# EAGLE design gearnode (EAGLE 5.07)
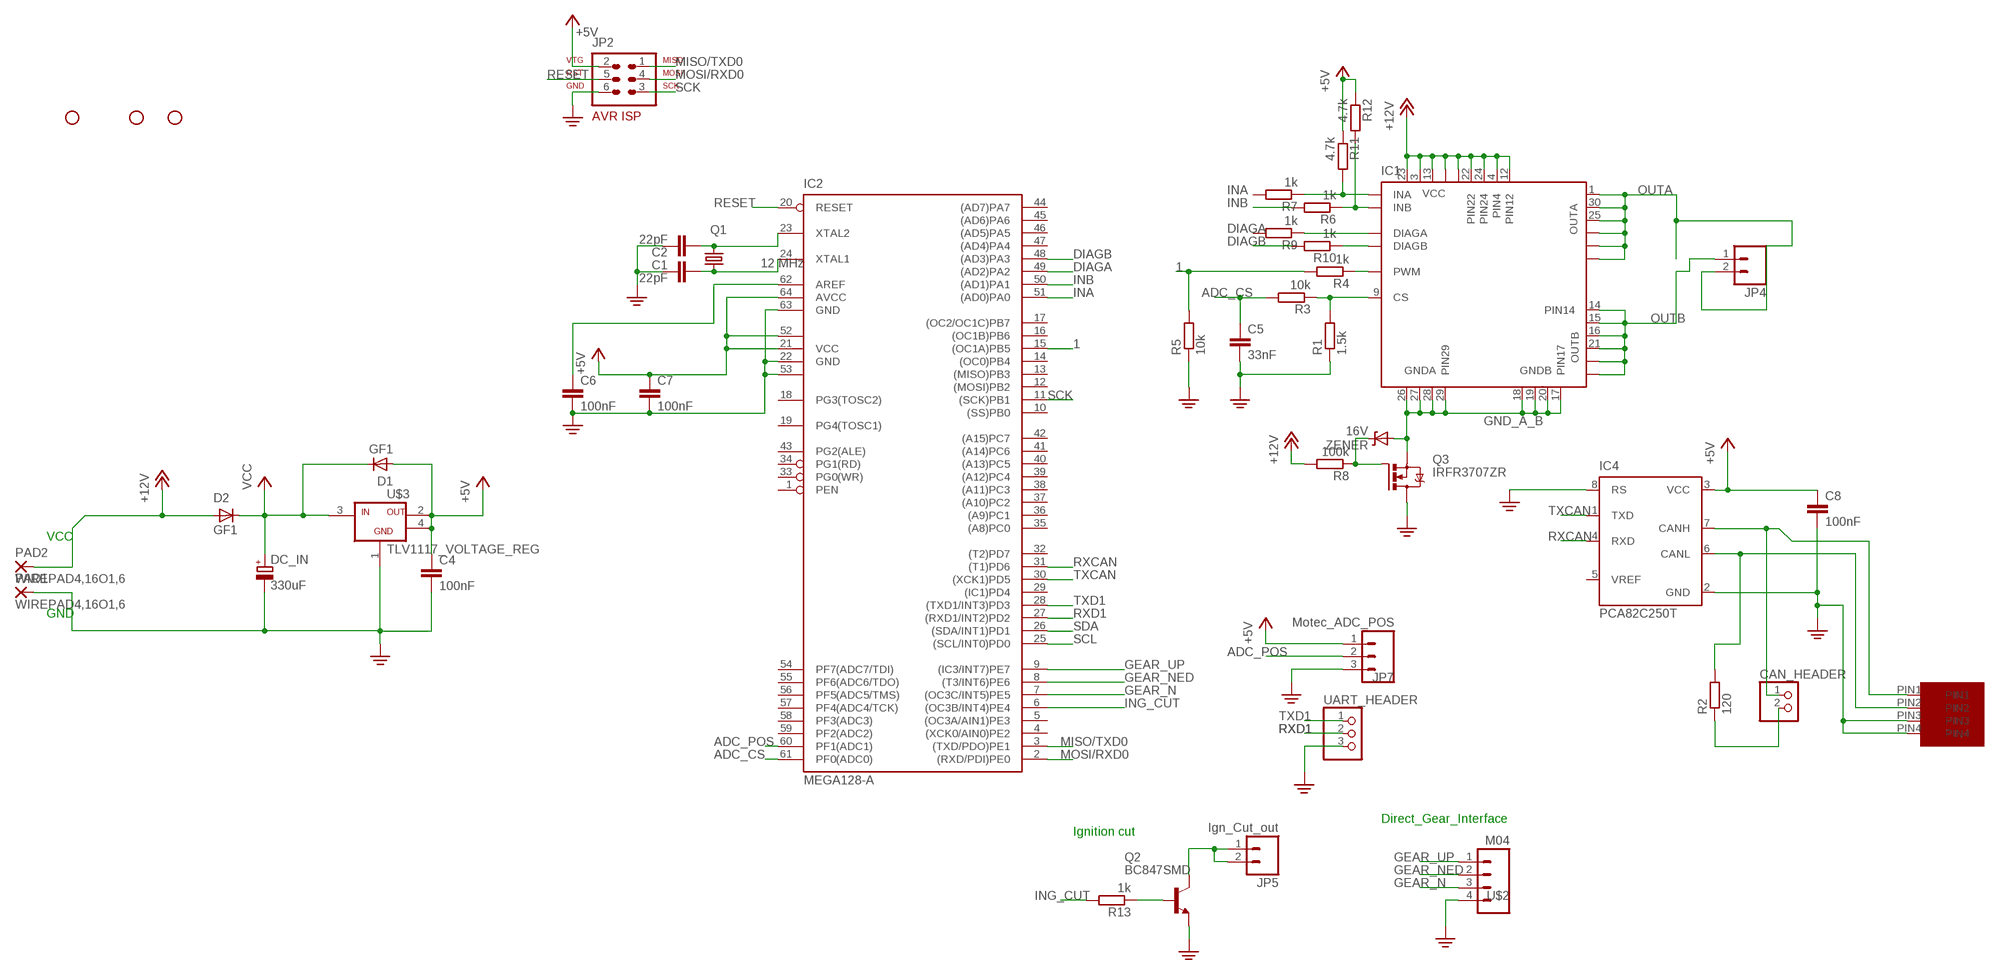
[diagram p0: schematic, sheet 1]

## Parts
C1  22pF  C5/2.5  [C5B2.5]
C2  22pF  C5/2.5  [C5B2.5]
C4  100nF  C-EUC0603K  [C0603K]
C5  33nF  C-EUC0603K  [C0603K]
C6  100nF  C-EUC0603K  [C0603K]
C7  100nF  C-EUC0603K  [C0603K]
C8  100nF  C-EUC0603K  [C0603K]
CAN_HEADER  PINHD-1X2  [1X02]
D1  GF1  [SMA-DO214AC]
D2  GF1  [SMA-DO214AC]
DC_IN  330uF  CPOL-EUE15-5AXIAL  [E15-5]
IC1  VNH2SP30  [MULTIPOWERSO-30]
IC2  MEGA128-A  [TQFP64]
IC4  PCA82C250T  [SO8]
JP1  STAND-OFF  [STAND-OFF]
JP2  AVR-ISP-6  [AVR-ISP-6]
JP3  STAND-OFF  [STAND-OFF]
JP4  M025MM  [SCREWTERMINAL-5MM-2]
JP5  Ign_Cut_out  M02-JST-2MM-SMT  [S2B-PH]
JP6  STAND-OFF  [STAND-OFF]
JP7  Motec_ADC_POS  M03  [S3B-PH]
PAD1  WIREPAD4,16O1,6  [4,16O1,6]
PAD2  WIREPAD4,16O1,6  [4,16O1,6]
Q1  12 MHz  CRYSTALHC49U70  [HC49U70]
Q2  BC847SMD  [SOT23]
Q3  IRFR3707ZR  [D-PAK_TO252AA]
R1  1.5k  R-EU_R0603  [R0603]
R2  120  R-EU_R0603  [R0603]
R3  10k  R-EU_R0603  [R0603]
R4  1k  R-EU_R0603  [R0603]
R5  10k  R-EU_R0603  [R0603]
R6  1k  R-EU_R0603  [R0603]
R7  1k  R-EU_R0603  [R0603]
R8  100k  R-EU_R0603  [R0603]
R9  1k  R-EU_R0603  [R0603]
R10  1k  R-EU_R0603  [R0603]
R11  4.7k  R-EU_R0603  [R0603]
R12  4.7k  R-EU_R0603  [R0603]
R13  1k  R-EU_R0603  [R0603]
U$1  MICROFIT4  [MICROFIT4SOCK]
U$2  M04  [S4B-PH]
U$3  TLV1117_VOLTAGE_REG  [SOT-232]
UART_HEADER  PINHD-1X3  [1X03]
ZENER  16V  DIODE-ZENER-BZT52  [SOD-323]

## Nets
1: IC2.15((OC1A)PB5) R4.2 R5.2
+5V: C4.1 C7.1 C8.1 D1.A IC2.21(VCC) IC2.52(VCC1) IC2.64(AVCC) IC4.3(VCC) JP2.2 JP7.1 R11.1 R12.1 U$3.2(VOUT) U$3.4(OUT2)
+12V: D2.A IC1.3(VCC) IC1.4(PIN4) IC1.12(PIN12) IC1.13(VCC) IC1.22(PIN22) IC1.23(VCC) IC1.24(PIN24) IC1.VCC IC1.VCC@1(VCC) PAD2.1(P) R8.2
ADC_CS: C5.1 IC2.61(PF0(ADC0)) R3.2
ADC_POS: IC2.60(PF1(ADC1)) JP7.2
CANJUMP1: CAN_HEADER.1 IC4.7(CANH) U$1.PIN1
CANJUMP2: CAN_HEADER.2 R2.1
DIAGA: IC2.49((AD2)PA2) R9.2
DIAGB: IC2.48((AD3)PA3) R10.2
GEAR_N: IC2.7((OC3C/INT5)PE5) U$2.3
GEAR_NED: IC2.8((T3/INT6)PE6) U$2.2
GEAR_UP: IC2.9((IC3/INT7)PE7) U$2.1
GND_A_B: IC1.17(PIN17) IC1.18(GNDB) IC1.19(GNDB) IC1.20(GNDB) IC1.26(GNDA) IC1.27(GNDA) IC1.28(GNDA) IC1.29(PIN29) Q3.3(S) ZENER.2(A)
INA: IC2.51((AD0)PA0) R7.2
INB: IC2.50((AD1)PA1) R6.2
ING_CUT: IC2.6((OC3B/INT4)PE4) R13.2
MISO/TXD0: IC2.3((TXD/PDO)PE1) JP2.1
MOSI/RXD0: IC2.2((RXD/PDI)PE0) JP2.4
N$1: C1.2 IC2.24(XTAL1) Q1.1
N$2: C2.2 IC2.23(XTAL2) Q1.2
N$3: IC1.8(PWM) R4.1
N$7: IC1.9(CS) R1.2 R3.1
N$8: Q3.1(G) R8.1 ZENER.1(C)
N$9: Q2.1(B) R13.1
N$10: C6.1 IC2.62(AREF)
N$11: JP5.1 JP5.2 Q2.3(C)
N$12: IC1.6(DIAGA) R9.1
N$14: IC1.10(DIAGB) R10.1
N$18: IC1.5(INA) R7.1 R11.2
N$19: IC1.11(INB) R6.1 R12.2
N$51: IC4.6(CANL) R2.2 U$1.PIN2
OUTA: IC1.1(OUTA) IC1.2(PIN2) IC1.25(OUTA) IC1.30(OUTA) IC1.OUTA IC1.OUTA@1(OUTA) JP4.2
OUTB: IC1.14(PIN14) IC1.15(OUTB) IC1.16(OUTB) IC1.21(OUTB) IC1.OUTB IC1.OUTB@1(OUTB) JP4.1
PE: C1.1 C2.1 C4.2 C5.2 C6.2 C7.2 C8.2 DC_IN.- IC2.22(GND) IC2.53(GND1) IC2.63(GND) IC4.2(GND) IC4.8(RS) JP2.6 JP7.3 PAD1.1(P) Q2.2(E) Q3.4(D) R1.1 R5.1 U$1.PIN3 U$1.PIN4 U$2.4 U$3.1(GND) UART_HEADER.3
RESET: IC2.20(RESET) JP2.5
RXCAN: IC2.31((T1)PD6) IC4.4(RXD)
RXD1: IC2.27((RXD1/INT2)PD2) UART_HEADER.2
SCK: IC2.11((SCK)PB1) JP2.3
SCL: IC2.25((SCL/INT0)PD0)
SDA: IC2.26((SDA/INT1)PD1)
TXCAN: IC2.30((XCK1)PD5) IC4.1(TXD)
TXD1: IC2.28((TXD1/INT3)PD3) UART_HEADER.1
VCC: D1.K(C) D2.K(C) DC_IN.+ U$3.3(VIN)
Unconnected: IC2.1(PEN) IC2.4((XCK0/AIN0)PE2) IC2.5((OC3A/AIN1)PE3) IC2.10((SS)PB0) IC2.12((MOSI)PB2) IC2.13((MISO)PB3) IC2.14((OC0)PB4) IC2.16((OC1B)PB6) IC2.17((OC2/OC1C)PB7) IC2.18(PG3(TOSC2)) IC2.19(PG4(TOSC1)) IC2.29((IC1)PD4) IC2.32((T2)PD7) IC2.33(PG0(WR)) IC2.34(PG1(RD)) IC2.35((A8)PC0) IC2.36((A9)PC1) IC2.37((A10)PC2) IC2.38((A11)PC3) IC2.39((A12)PC4) IC2.40((A13)PC5) IC2.41((A14)PC6) IC2.42((A15)PC7) IC2.43(PG2(ALE)) IC2.44((AD7)PA7) IC2.45((AD6)PA6) IC2.46((AD5)PA5) IC2.47((AD4)PA4) IC2.54(PF7(ADC7/TDI)) IC2.55(PF6(ADC6/TDO)) IC2.56(PF5(ADC5/TMS)) IC2.57(PF4(ADC4/TCK)) IC2.58(PF3(ADC3)) IC2.59(PF2(ADC2)) IC4.5(VREF)

## Notes on the sheet
- VCC
- GND
- Direct_Gear_Interface
- Ignition cut

## Library data of the parts
C1 C2 = capacitor-wima:C: CAPACITOR naming: grid - package width
C4-C8 = rcl:C-EU: CAPACITOR, European symbol
CAN_HEADER = pinhead:PINHD-1X2: PIN HEADER
D1 D2 = diode:GF1: DIODE
DC_IN = rcl:CPOL-EU: POLARIZED CAPACITOR, European symbol
IC1 = UNICORN:VNH2SP30: FULLY INTEGRATED H-BRIDGE MOTOR DRIVER Source: http://pdf1.alldatasheet.com/datasheet-pdf/view/84563/STMICROELECTRONICS/VNH3SP30.html
IC2 = atmel:MEGA128: MICROCONTROLLER 128 Kbytes FLASH 4 Kbytes SRAM 4 Kbytes EEPROM DUAL USART 8-channel 10 bit ADC Source: avr.lbr
IC4 = micro-philips:PCA82C250: CAN CONTROLLER INTERFACE
JP1 JP3 JP6 = SparkFun:STAND-OFF: Stand Off This is the mechanical footprint for a #4 phillips button head screw. Use the keepout ring to avoid running the screw head into surrounding components. SKU : PRT-00447
JP2 = avr-5:AVR-ISP-6: AVR ISP-6 Serial Programming Header
JP4 = SparkFun:M02: Header 2 Standard 2-pin 0.1" header. Use with straight break away headers (SKU : PRT-00116), right angle break away headers (PRT-00553), swiss pins (PRT-00743), machine pins (PRT-00117), and female headers (PRT-00115). Molex polarized connector foot print use with SKU : PRT-08233 with associated crimp pins and housings.
JP5 = unicorn_v2:M02: Header 2 Standard 2-pin 0.1" header. Use with straight break away headers (SKU : PRT-00116), right angle break away headers (PRT-00553), swiss pins (PRT-00743), machine pins (PRT-00117), and female headers (PRT-00115). Molex polarized connector foot print use with SKU : PRT-08233 with associated crimp pins and housings.
JP7 = unicorn_v2:M03: Header 2 Standard 2-pin 0.1" header. Use with straight break away headers (SKU : PRT-00116), right angle break away headers (PRT-00553), swiss pins (PRT-00743), machine pins (PRT-00117), and female headers (PRT-00115). Molex polarized connector foot print use with SKU : PRT-08233 with associated crimp pins and housings.
PAD1 PAD2 = wirepad:WIREPAD: Wire PAD connect wire on PCB
Q1 = crystal:CRYSTAL: CRYSTAL
Q2 = transistor-npn:BC847*: NPN Transistor
Q3 = UNICORN:IRFR3707Z: HEXFET Power MOSFET Source: http://www.irf.com/product-info/datasheets/data/irfr5305pbf.pdf
R1-R13 = resistor:R-EU_: RESISTOR, European symbol
U$1 = UNICORN:MICROFIT4
U$2 = unicorn_v2:M04
U$3 = unicorn_v2:TLV1117_VOLTAGE_REG
UART_HEADER = pinhead:PINHD-1X3: PIN HEADER
ZENER = SparkFun:DIODE-ZENER: Zener Diode Production Part - 8199 3.4V Zener Voltage

## Board
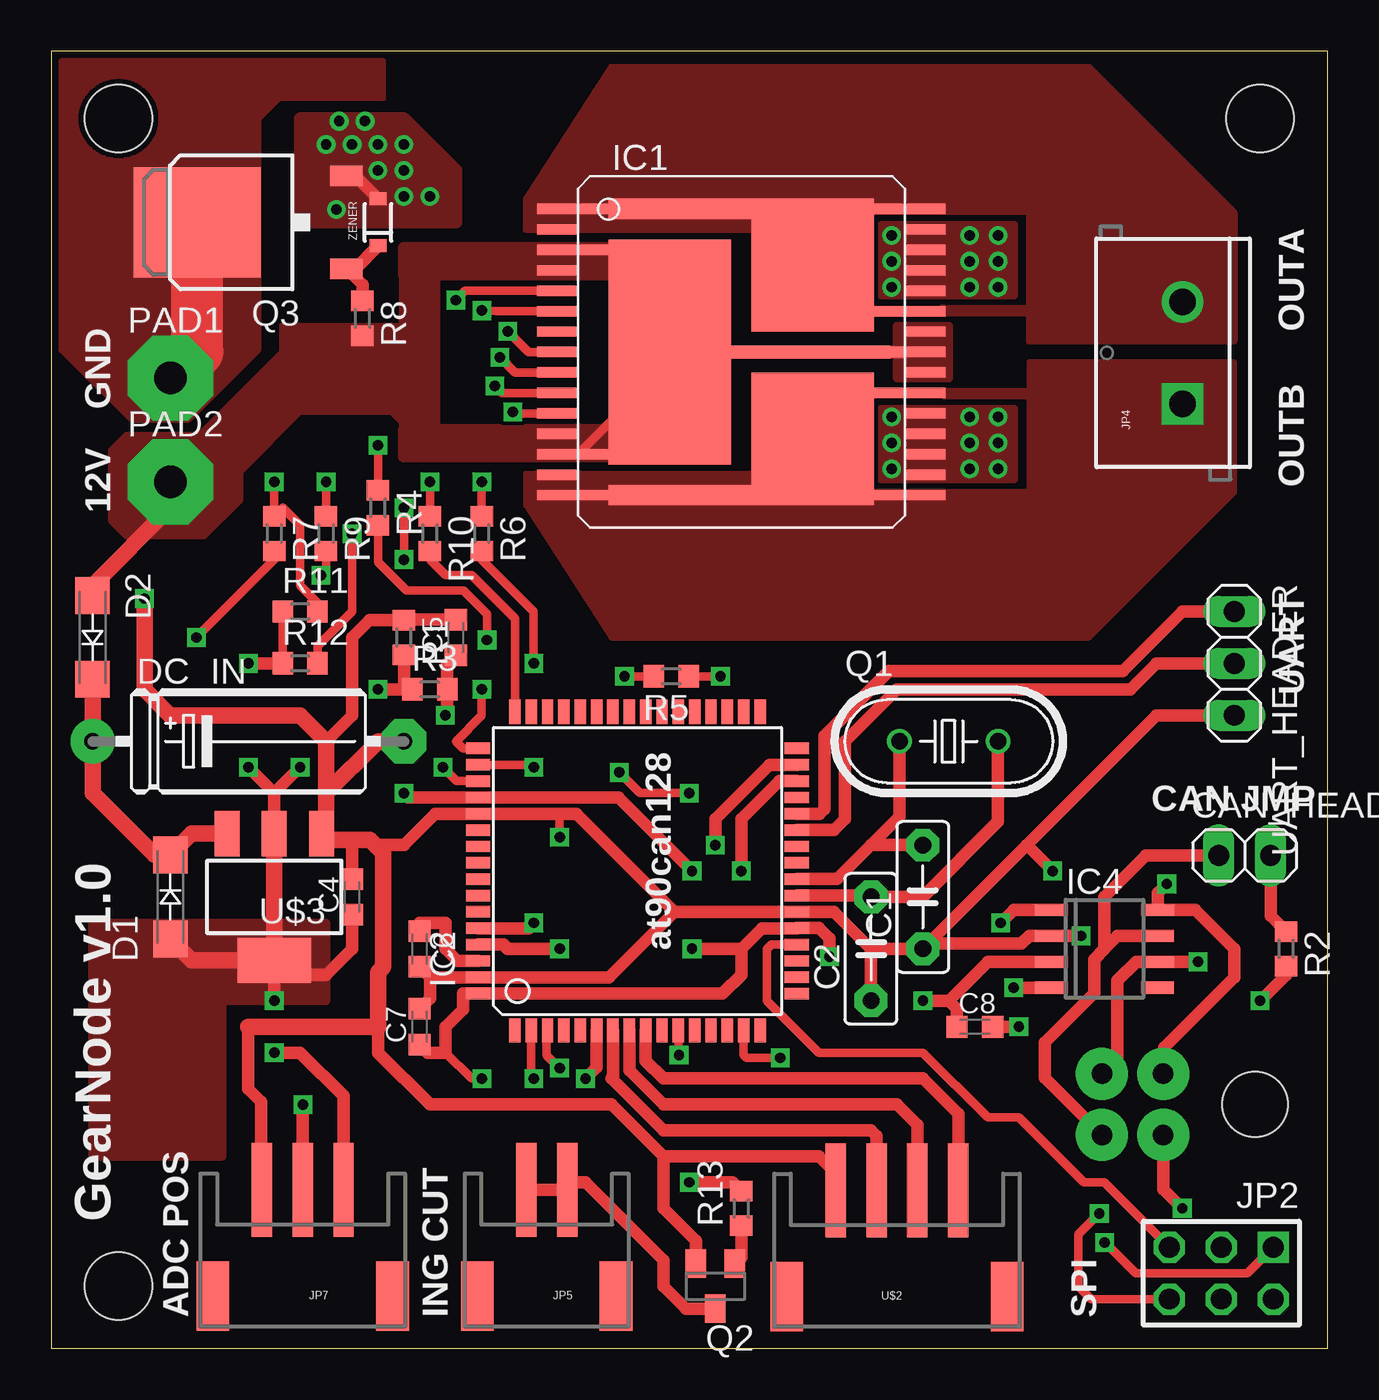
[diagram p1: board, top side]
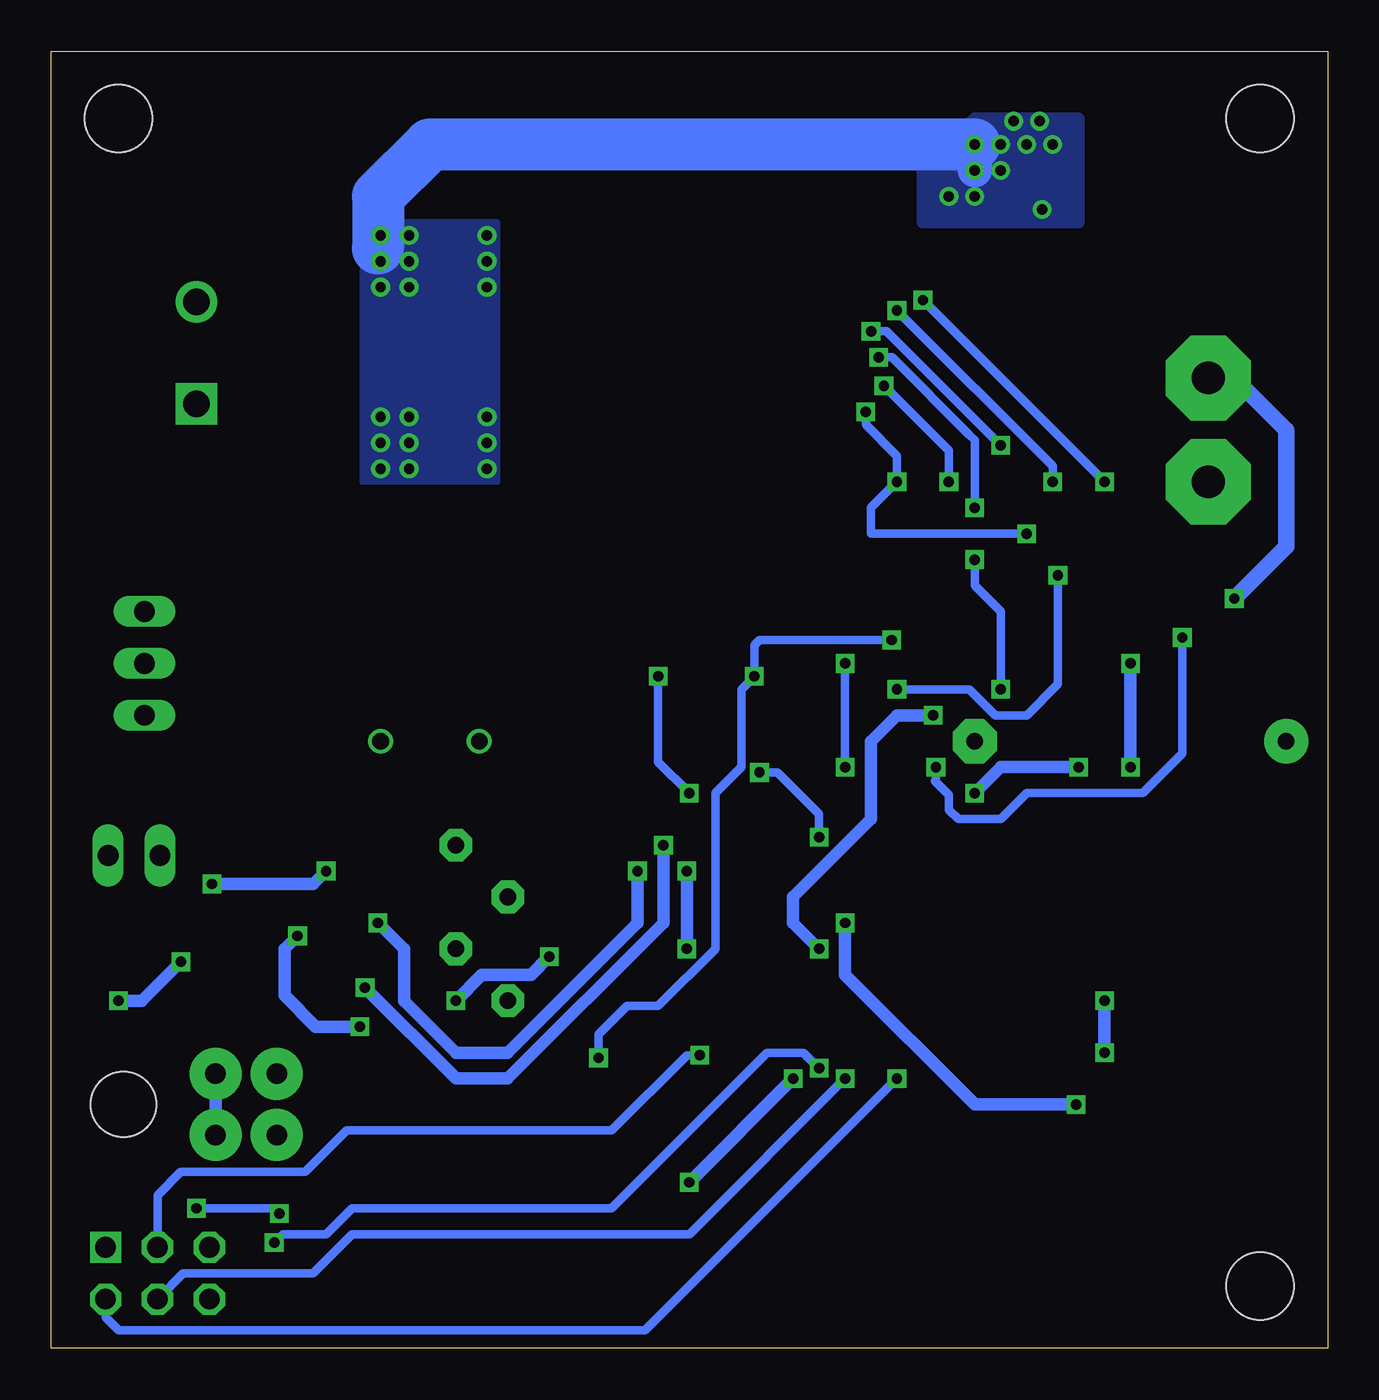
[diagram p2: board, bottom side, seen from below]

Size 62.48 x 63.5 mm. Coordinates in mm from the lower left corner, seen from the top.
Outline: 0,0 62.48,0 62.48,63.5 0,63.5 0,0
Copper layers (1*16): Top 0.035mm / dielectric 1.5mm / Bottom 0.035mm
Design rules "default *": minimum track width 8mil, minimum drill 20mil, track to track 8mil, track to pad 8mil, pad to pad 8mil, via to via 8mil, smd to smd 8mil, copper to edge 8mil, drill to drill 8mil, minimum pad ring 8mil, minimum via ring 8mil, stop-mask expansion 4mil, vias tented up to drill 0mil, thermal gap 10mil

### Footprints (pad centres in the part's own frame; a part is rotated, then mirrored left to right if it is on the bottom)
C5B2.5 = drill 0.813 pad 1.6 octagon: 1 -2.54,0; 2 2.54,0
C0603K = smd 1.05 x 1.08: 1 -0.875,0; 2 0.875,0
1X02 = drill 1.016 long: 1 -1.27,0; 2 1.27,0
SMA-DO214AC = smd 1.8 x 1.7: A -2.05,0; K 2.05,0
E15-5 = drill 0.813 pad 2.159 round: + -7.62,0 | drill 0.813 pad 2.159 octagon: - 7.62,0
MULTIPOWERSO-30 = smd 0.508 x 12: 1 -7,-4; 15 7,-4; 16 7,4; 30 -7,4 | smd 0.508 x 2: 2 -6,-9; 4 -4,-9; 5 -3,-9; 6 -2,-9; 7 -1,-9; 8 0,-9; 9 1,-9; 10 2,-9; 11 3,-9; 12 4,-9; 14 6,-9; 17 6,9; 18 5,9; 19 4,9; 20 3,9; 22 1,9; 24 -1,9; 26 -3,9; 27 -4,9; 28 -5,9; 29 -6,9 | smd 0.508 x 4: 3 -5,-8; 13 5,-8; 21 2,8; 23 0,8; 25 -2,8 | smd 6.5 x 6: OUTA -4.25,3.5; OUTB 4.25,3.5 | smd 1 x 7.5: OUTA@1 -7,-2.755; OUTB@1 7,-2.755 | smd 11 x 6: VCC 0,-3.5 | smd 0.65 x 8.3: VCC@1 0,3.145
TQFP64 = smd 1.194 x 0.559: 1 -7.8,6; 2 -7.8,5.2; 3 -7.8,4.4; 4 -7.8,3.6; 5 -7.8,2.8; 6 -7.8,2; 7 -7.8,1.2; 8 -7.8,0.4; 9 -7.8,-0.4; 10 -7.8,-1.2; 11 -7.8,-2; 12 -7.8,-2.8; 13 -7.8,-3.6; 14 -7.8,-4.4; 15 -7.8,-5.2; 16 -7.8,-6; 33 7.8,-6; 34 7.8,-5.2; 35 7.8,-4.4; 36 7.8,-3.6; 37 7.8,-2.8; 38 7.8,-2; 39 7.8,-1.2; 40 7.8,-0.4; 41 7.8,0.4; 42 7.8,1.2; 43 7.8,2; 44 7.8,2.8; 45 7.8,3.6; 46 7.8,4.4; 47 7.8,5.2; 48 7.8,6 | smd 0.559 x 1.194: 17 -6,-7.8; 18 -5.2,-7.8; 19 -4.4,-7.8; 20 -3.6,-7.8; 21 -2.8,-7.8; 22 -2,-7.8; 23 -1.2,-7.8; 24 -0.4,-7.8; 25 0.4,-7.8; 26 1.2,-7.8; 27 2,-7.8; 28 2.8,-7.8; 29 3.6,-7.8; 30 4.4,-7.8; 31 5.2,-7.8; 32 6,-7.8; 49 6,7.8; 50 5.2,7.8; 51 4.4,7.8; 52 3.6,7.8; 53 2.8,7.8; 54 2,7.8; 55 1.2,7.8; 56 0.4,7.8; 57 -0.4,7.8; 58 -1.2,7.8; 59 -2,7.8; 60 -2.8,7.8; 61 -3.6,7.8; 62 -4.4,7.8; 63 -5.2,7.8; 64 -6,7.8
SO8 = smd 0.6 x 1.6: 1 -1.905,-2.6; 2 -0.635,-2.6; 3 0.635,-2.6; 4 1.905,-2.6; 5 1.905,2.6; 6 0.635,2.6; 7 -0.635,2.6; 8 -1.905,2.6
STAND-OFF = hole 3.302: 0,0
AVR-ISP-6 = drill 1.016 square: 1 -2.54,-1.27 | drill 1.016 octagon: 2 -2.54,1.27; 3 0,-1.27; 4 0,1.27; 5 2.54,-1.27; 6 2.54,1.27
SCREWTERMINAL-5MM-2 = drill 1.3 pad 2.032 square: 1 0,0 | drill 1.3 pad 2.032 round: 2 5,0
S2B-PH = smd 1 x 4.6: 1 -1,-3.7; 2 1,-3.7 | smd 1.6 x 3.4: NC1 -3.4,1.5; NC2 3.4,1.5
S3B-PH = smd 1 x 4.6: 1 -2,-2.43; 2 0,-2.43; 3 2,-2.43 | smd 1.6 x 3.4: NC1 -4.4,2.77; NC2 4.4,2.77
4,16O1,6 = drill 1.6 pad 4.166 octagon: 1 0,0
HC49U70 = drill 0.813 round: 1 -2.413,0; 2 2.413,0
SOT23 = smd 1 x 1.4: 1 -0.95,-1.1; 2 0.95,-1.1; 3 0,1.1
D-PAK_TO252AA = smd 1 x 1.6: 1 -2.28,-4.8; 3 2.28,-4.8 | smd 5.4 x 6.2: 4 0,2.5
R0603 = smd 1 x 1.1: 1 -0.85,0; 2 0.85,0
MICROFIT4SOCK = drill 1 pad 2.54 round: PIN1 -2,0; PIN2 1,0; PIN3 -2,-3; PIN4 1,-3 | hole 3.2: -0.5,-7.5
S4B-PH = smd 1 x 4.6: 1 -3,-2.16; 2 -1,-2.16; 3 1,-2.16; 4 3,-2.16 | smd 1.6 x 3.4: NC1 -5.4,3.04; NC2 5.4,3.04
SOT-232 = smd 1.219 x 2.235: 1 -2.311,-3.099; 2 0,-3.099; 3 2.311,-3.099 | smd 3.6 x 2.2: 4 0,3.099
1X03 = drill 1.016 long: 1 -2.54,0; 2 0,0; 3 2.54,0
SOD-323 = smd 0.63 x 0.83: 1 -1.15,0; 2 1.15,0

### Placement (x,y rotation side)
C1  42.67,22.1 90 top
C2  40.13,19.56 90 top
C4  14.73,22.1 90 top
C5  19.81,34.8 90 top
C6  18.03,19.56 270 top
C7  18.03,15.75 90 top
C8  45.21,15.75 0 top
CAN_HEADER  58.42,24.13 0 top
D1  5.84,22.1 90 top
D2  2.03,34.8 270 top
DC_IN  9.65,29.72 0 top
IC1  33.78,48.77 270 top
IC2  28.7,23.37 90 top
IC4  51.56,19.56 270 top
JP1  3.3,60.2 0 top
JP2  57.28,3.68 180 top
JP3  3.3,3.05 0 top
JP4  55.37,46.23 90 top
JP5  24.26,4.06 180 top
JP6  59.18,60.2 0 top
JP7  12.32,5.33 180 top
PAD1  5.84,47.5 0 top
PAD2  5.84,42.42 0 top
Q1  43.94,29.72 0 top
Q2  32.51,3.05 180 top
Q3  9.65,55.12 90 top
R1  17.27,34.8 270 top
R2  60.45,19.56 270 top
R3  18.54,32.26 0 top
R4  16,41.15 270 top
R5  30.35,32.89 180 top
R6  21.08,39.88 270 top
R7  10.92,39.88 270 top
R8  15.24,50.42 270 top
R9  13.46,39.88 270 top
R10  18.54,39.88 270 top
R11  12.19,36.07 0 top
R12  12.19,33.53 0 top
R13  33.78,6.86 90 top
U$1  51.44,12.45 90 top
U$2  41.4,5.59 180 top
U$3  10.92,22.1 180 top
UART_HEADER  57.91,33.53 270 top
ZENER  16,55.12 90 top

### Tracks (layer width: path | path; a pad name or v marks a point on that pad's centre or on a via)
1  (via drill 0.51)
  Top 0.406: 27.81,33.15 v28.07,32.89 R5.2 | IC2.15 33.9,14.36 34.04,14.22 v35.69,14.22 | R4.2 16,38.48 17.4,37.08 20.19,37.08 21.34,35.94 v21.34,34.67
  Bottom 0.406: v35.69,14.22 35.69,15.37 34.29,16.76 32.77,16.76 29.97,19.56 29.97,27.18 28.7,28.45 28.7,32.26 v28.07,32.89 28.07,34.42 27.81,34.67 v21.34,34.67
+5V  (via drill 0.51)
  Top 0.406: v21.08,13.21 20.57,13.21 19.3,14.48 | R12.1 R11.1
  Top 0.61: v31.37,23.37 27.77,26.97 IC2.52 17.48,26.97 v17.27,27.18 | v31.37,19.56 33.78,19.56 | 33.78,19.56 34.79,20.57 IC2.21 37.59,20.57 38.1,20.07 v38.1,19.18 | 33.78,19.56 33.78,18.29 32.86,17.37 IC2.64 20.16,17.37 20.16,16.61 19.3,15.75 19.3,14.48 18.43,14.48 C7.1 | IC4.3 45.85,18.92 43.94,17.02 | v42.67,17.02 43.94,17.02 | C4.1 14.73,19.56 13.46,18.29 12.19,18.29 10.92,19.56 | v10.92,17.02 10.92,24.64 10.92,27.18 | 10.92,27.18 v12.19,28.45 | JP7.1 14.32,12.35 12.19,14.48 v10.92,14.48 | v9.65,33.53 R12.1 | 10.92,27.18 v9.65,28.45 | C8.1 44.34,16.62 43.94,17.02
  Top 0.813: U$3.2 10.92,24.64 10.92,19.56 U$3.4 10.21,19 | D1.A 6.89,19 10.21,19 | 10.21,19 10.92,18.29
  Bottom 0.406: JP2.2 59.82,1.52 59.18,0.89 33.4,0.89 v21.08,13.21
  Bottom 0.61: v31.37,23.37 v31.37,19.56 | v42.67,17.02 41.4,18.29 38.99,18.29 v38.1,19.18 | v12.19,28.45 16,28.45 v17.27,27.18 | v10.92,14.48 v10.92,17.02 | v9.65,28.45 v9.65,33.53
  pour Top (no thermals): 8.38,9.4 2.03,9.4 2.03,20.83 13.46,20.83 13.46,17.02 8.38,17.02
+12V
  Top 0.406: IC1.VCC@1 30.78,48.77 30.38,48.36 IC1.13
  Top 0.61: IC1.VCC 30.28,48.46 30.38,48.36 | IC1.VCC@1 IC1.23
  Top 0.813: PAD2.1 5.84,41.15 2.03,37.34 D2.A
  pour Top (no thermals): 27.43,53.85 17.27,53.85 17.27,52.58 27.43,52.58
  pour Top (no thermals): 27.43,44.96 17.27,44.96 17.27,43.69 27.43,43.69
  pour Top (no thermals): 43.94,50.04 43.94,47.5 41.4,47.5 41.4,50.04
  pour Top (no thermals): 17.14,53.85 17.14,50.04 11.3,50.04 11.3,48.77 7.24,44.7 3.68,44.7 2.92,43.94 2.92,40.51 3.68,39.75 7.49,39.75 9.27,41.53 9.27,42.93 12.19,45.85 16.64,45.85 17.14,45.34 17.14,43.56 18.92,43.56 18.92,53.98 17.27,53.98
ADC_CS  (via drill 0.51)
  Top 0.61: C5.1 19.39,33.5 R3.2 19.39,31.41 v19.3,30.99 | v24.89,19.56 22.35,19.56 22.14,19.77 IC2.61
  Bottom 0.61: v19.3,30.99 21.08,30.99 22.35,29.72 22.35,25.91 26.16,22.1 26.16,20.83 v24.89,19.56
ADC_POS  (via drill 0.51)
  Top 0.61: JP7.2 v12.32,11.94 | IC2.60 23.36,20.57 v23.62,20.83
  Bottom 0.61: v23.62,20.83 23.62,18.29 17.27,11.94 v12.32,11.94
CANJUMP1
  Top 0.61: IC4.7 52.2,20.19 51.56,19.56 | 51.56,19.56 51.05,19.05 51.05,17.4 48.64,14.99 48.64,13.24 U$1.PIN1 | CAN_HEADER.1 53.59,24.13 51.56,22.1 51.56,19.56
CANJUMP2
  Top 0.61: CAN_HEADER.2 59.69,21.17 R2.1
DIAGA  (via drill 0.51)
  Top 0.406: R9.2 13.46,38.1 v13.21,37.85 | v21.08,32.26 21.08,30.99 19.81,29.72 20.16,29.37 IC2.49
  Bottom 0.406: v13.21,37.85 13.21,32.51 14.73,30.99 16.26,30.99 17.53,32.26 v21.08,32.26
DIAGB
  Top 0.406: R10.2 18.54,38.61 19.3,37.85 20.57,37.85 22.7,35.72 IC2.48
GEAR_N
  Top 0.61: U$2.3 40.4,10.4 40.13,10.67 29.97,10.67 27.43,13.21 27.5,13.28 IC2.7
GEAR_NED
  Top 0.61: IC2.8 28.3,13.61 29.97,11.94 41.4,11.94 42.4,10.94 U$2.2
GEAR_UP
  Top 0.61: U$2.1 44.4,11.48 42.67,13.21 29.97,13.21 29.1,14.08 IC2.9
GND_A_B  (via drill 0.51)
  Top 0.61: Q3.3 14.87,57.4 ZENER.2
  Bottom 1.676: v17.27,57.66 v17.27,58.93
  Bottom 2.54: 46.48,53.85 46.48,56.39 43.94,58.93 v17.27,58.93
  other vias: 44.96,54.48 46.36,54.48 44.96,53.21 44.96,51.94 46.36,53.21 46.36,51.94 44.96,45.59 46.36,45.59 44.96,44.32 44.96,43.05 46.36,43.05 46.36,44.32 41.15,54.48 41.15,53.21 41.15,51.94 41.15,45.59 41.15,44.32 41.15,43.05 13.46,58.93 14.73,58.93 16,58.93 18.54,56.39 13.97,55.75 16,57.66 17.27,56.39 14.1,60.07 15.37,60.07
  pour Top (no thermals): 40.64,51.56 47.12,51.56 47.12,54.99 40.64,54.99
  pour Top (no thermals): 40.64,42.55 47.12,42.55 47.12,45.97 40.64,45.97
  pour Bottom (no thermals): 47.24,55.12 47.24,42.42 40.64,42.42 40.64,55.12
  pour Top (no thermals): 12.19,55.12 19.81,55.12 19.81,57.66 17.27,60.2 12.19,60.2
  pour Bottom (no thermals): 12.19,55.12 19.81,55.12 19.81,57.66 17.27,60.2 12.19,60.2
INA  (via drill 0.51)
  Top 0.406: R7.2 10.92,38.61 v7.11,34.8 | IC2.51 19.86,27.77 v19.18,28.45
  Bottom 0.406: v7.11,34.8 7.11,29.12 9.05,27.18 14.73,27.18 16,25.91 18.08,25.91 18.54,26.37 18.54,27.09 19.22,27.77 19.18,27.81 v19.18,28.45
INB  (via drill 0.51)
  Top 0.406: R6.2 21.08,38.61 23.62,36.07 v23.62,33.53 | IC2.50 23.5,28.57 v23.62,28.45
  Bottom 0.406: v23.62,28.45 v23.62,33.53
ING_CUT  (via drill 0.51)
  Top 0.61: IC2.6 26.7,13.75 v26.16,13.21 | v31.24,8.13 33.36,8.13 R13.2
  Bottom 0.61: v26.16,13.21 v31.24,8.13
MISO/TXD0  (via drill 0.51)
  Top 0.406: IC2.3 24.26,15.52 24.26,14.35 v24.89,13.72 | v51.56,5.19 51.58,5.19 53.09,3.68 58.55,3.68 JP2.1
  Bottom 0.406: v51.56,5.19 51.16,5.59 49.02,5.59 47.75,6.86 35.05,6.86 27.43,14.48 25.65,14.48 v24.89,13.72
MOSI/RXD0  (via drill 0.51)
  Top 0.406: IC2.2 23.5,13.33 v23.62,13.21
  Bottom 0.406: v23.62,13.21 31.24,5.59 47.75,5.59 49.66,3.68 56.01,3.68 JP2.4
N$1
  Top 0.61: IC2.24 38.46,22.97 40.13,24.64 | 40.13,24.64 C1.2 | Q1.1 41.53,26.04 40.13,24.64
N$2
  Top 0.61: IC2.23 40.06,22.17 C2.2 42.67,22.1 46.36,25.78 Q1.2
N$3  (via drill 0.51)
  Top 0.406: IC1.8 23.37,48.77 v22.35,49.78 | R4.1 v16,44.2
  Bottom 0.406: v22.35,49.78 21.59,49.78 v16,44.2
N$7  (via drill 0.51)
  Top 0.406: IC1.9 22.72,47.77 v21.97,48.51 | v17.27,38.61 v17.27,41.15
  Top 0.61: R1.2 17.27,32.68 R3.1 v16,32.26
  Bottom 0.406: v16,32.26 16,36.07 17.27,37.34 v17.27,38.61 | v21.97,48.51 21.34,48.51 17.53,44.7 17.27,44.45 v17.27,41.15
N$8
  Top 0.61: ZENER.1 14.87,52.84 Q3.1 14.71,52.58 14.73,52.58 15.24,52.07 R8.1
N$9
  Top 0.61: R13.1 33.78,4.47 Q2.1
N$10
  Top 0.61: IC2.62 19.89,18.97 19.3,19.56 19.3,20.83 18.03,20.83 C6.1
N$11
  Top 0.61: Q2.3 31.07,1.95 29.97,3.05 29.97,4.32 26.16,8.13 25.62,8.13 JP5.1 JP5.2
N$12  (via drill 0.51)
  Top 0.406: IC1.6 21.81,50.77 v21.08,50.8 | R9.1 v13.46,42.42
  Bottom 0.406: v13.46,42.42 13.46,43.18 v21.08,50.8
N$14  (via drill 0.51)
  Top 0.406: R10.1 v18.54,42.42 | IC1.10 22.07,46.77 v21.72,47.12
  Bottom 0.406: v18.54,42.42 18.54,43.94 v21.72,47.12
N$18  (via drill 0.51)
  Top 0.406: IC1.5 20.27,51.77 v19.81,51.31 | v10.92,42.42 R7.1 11.34,41.15 12.19,40.3 12.19,37.34 13.04,36.49 R11.2
  Bottom 0.406: v10.92,42.42 v19.81,51.31
N$19  (via drill 0.51)
  Top 0.406: v21.08,42.42 R6.1 | IC1.11 22.68,45.77 v22.61,45.85 | R12.2 13.04,34.38 14.73,36.07 v14.73,39.88
  Bottom 0.406: v22.61,45.85 22.61,45.21 21.08,43.69 v21.08,42.42 22.35,41.15 22.35,39.88 v14.73,39.88
N$51  (via drill 0.51)
  Top 0.61: R2.2 60.45,18.29 v59.18,17.02 | v56.13,18.92 IC4.6 53.11,18.92 52.2,18.01 52.2,14.21 U$1.PIN2
  Bottom 0.61: v59.18,17.02 58.04,17.02 v56.13,18.92
OUTA
  pour Top (no thermals): 40.13,49.91 34.42,49.91 34.42,54.74 23.24,54.74 23.24,56.26 27.43,62.74 50.79,62.74 57.91,55.62 57.91,49.28 47.88,49.28 47.88,55.63 40.13,55.63
  pour Top (no thermals): 43.56,50.93 43.56,50.67 49.15,50.67 49.15,50.93
OUTB
  pour Top (no thermals): 40.13,47.62 34.42,47.62 34.42,42.8 23.24,42.8 23.24,41.28 27.43,34.8 50.79,34.8 57.91,41.92 57.91,48.26 47.88,48.26 47.88,41.91 40.13,41.91
  pour Top (no thermals): 43.69,46.86 43.69,46.61 49.28,46.61 49.28,46.86
PE  (via drill 0.51)
  Top 0.406: JP2.6 50.93,2.41 50.29,3.05 50.29,5.59 v51.31,6.6 | v32.77,32.89 R5.1 | v31.24,27.18 28.83,27.18 v27.81,28.19 | 24.89,26.17 v24.89,25.02
  Top 0.61: 18.55,18.17 C6.2 | 30.51,21.37 IC2.22 38.32,21.37 40.13,19.56 | 30.51,21.37 27.31,18.17 IC2.63 18.55,18.17 | 30.51,21.37 25.71,26.17 24.89,26.17 IC2.53 18.8,26.17 17.27,24.64 16,24.64 15.94,24.57 | 18.55,18.17 18.55,17.14 C7.2 | 40.13,19.56 C2.1 | 40.13,19.56 C1.1 | C1.1 47.75,24.64 | 16,15.75 16,14.48 18.54,11.94 27.43,11.94 29.97,9.4 | U$2.4 38.4,8.59 37.59,9.4 29.97,9.4 | Q2.2 31.56,5.27 29.97,6.86 29.97,9.4 | C1.1 42.93,19.81 47.5,19.81 47.88,20.19 IC4.2 v50.42,20.19 | v54.61,22.73 54.16,22.29 IC4.8 56.01,21.46 57.91,19.56 57.91,18.16 54.48,14.73 54.48,13.49 U$1.PIN4 | 47.75,24.64 v49.02,23.37 | 9.65,15.75 9.65,12.7 10.29,12.07 10.29,7.8 JP7.3 | C5.2 17.3,35.67 R1.1 15.58,35.65 14.73,34.8 14.73,30.99 13.46,29.72 | v47.37,15.75 C8.2 | 14.73,24.89 C4.2 | 47.75,24.64 54.1,30.99 UART_HEADER.3 | U$1.PIN3 54.44,7.79 v55.37,6.86
  Top 0.813: DC_IN.- 16,29.72 13.46,27.18 | 13.46,27.18 13.46,25.43 U$3.1 13.54,24.89 14.73,24.89 15.62,24.89 15.94,24.57 16.26,24.26 16.26,18.67 16,18.41 16,15.75 9.65,15.75 | 13.46,27.18 13.46,29.72 12.19,30.99 5.84,30.99 4.57,32.26 v4.57,36.7
  Top 2.54: Q3.4 7.15,48.81 PAD1.1
  Bottom 0.406: v55.37,6.86 51.56,6.86 v51.31,6.6 | v32.77,32.89 32.77,28.7 v31.24,27.18 | v27.81,28.19 26.92,28.19 24.89,26.17 v24.89,25.02
  Bottom 0.61: U$1.PIN4 U$1.PIN3 | v54.61,22.73 49.66,22.73 v49.02,23.37 | v47.37,15.75 49.53,15.75 51.05,17.27 51.05,19.56 v50.42,20.19
  Bottom 0.813: PAD1.1 4.57,47.5 2.03,44.96 2.03,39.24 v4.57,36.7
  pour Top (no thermals): 10.16,57.79 10.16,60.2 11.18,61.21 16.26,61.21 16.26,62.99 0.51,62.99 0.51,54.61 0.51,48.9 3.94,45.47 6.73,45.47 10.16,48.9 10.16,57.66
RESET
  Top 0.406: IC2.20 35.26,19.77 35.05,19.56 35.05,17.02 37.59,14.48 42.67,14.48 45.85,11.3 47.37,11.3 50.55,8.13 51.56,8.13 JP2.5
RXCAN  (via drill 0.51)
  Top 0.61: IC2.31 35.17,28.57 32.51,25.91 v32.51,24.64 | v47.12,17.65 IC4.4
  Bottom 0.61: v32.51,24.64 32.51,20.83 40.13,13.21 42.67,13.21 v47.12,17.65
RXD1
  Top 0.61: IC2.27 38.32,25.37 38.86,25.91 38.86,29.72 41.4,32.26 52.83,32.26 54.1,33.53 UART_HEADER.2
SCK  (via drill 0.51)
  Top 0.406: IC2.11 30.7,14.38 v30.73,14.35
  Bottom 0.406: v30.73,14.35 31.37,14.35 35.05,10.67 48.01,10.67 50.04,8.64 56.13,8.64 57.28,7.49 JP2.3
TXCAN  (via drill 0.51)
  Top 0.61: IC2.30 35.64,27.77 33.78,25.91 v33.78,23.37 | IC4.1 47.12,21.46 v46.48,20.83
  Bottom 0.61: v33.78,23.37 33.78,20.83 40.13,14.48 42.67,14.48 45.21,17.02 45.21,19.56 v46.48,20.83
TXD1
  Top 0.61: IC2.28 37.6,26.17 37.85,26.42 37.85,29.97 41.02,33.15 52.45,33.15 55.37,36.07 UART_HEADER.1
VCC
  Top 0.813: U$3.3 6.89,25.2 D1.K 5.06,24.15 2.03,27.18 DC_IN.+ D2.K

### Text on the board
tPlace: OUTA | GND | OUTB | 12V | UART | at90can128 | CAN JMP | GearNode v1.0 | ADC POS | ING CUT | SPI